# EAGLE design mbedUSBBorderRouter-V_1_0_0 (EAGLE 7.6.0)

## Sheet 1 of 3
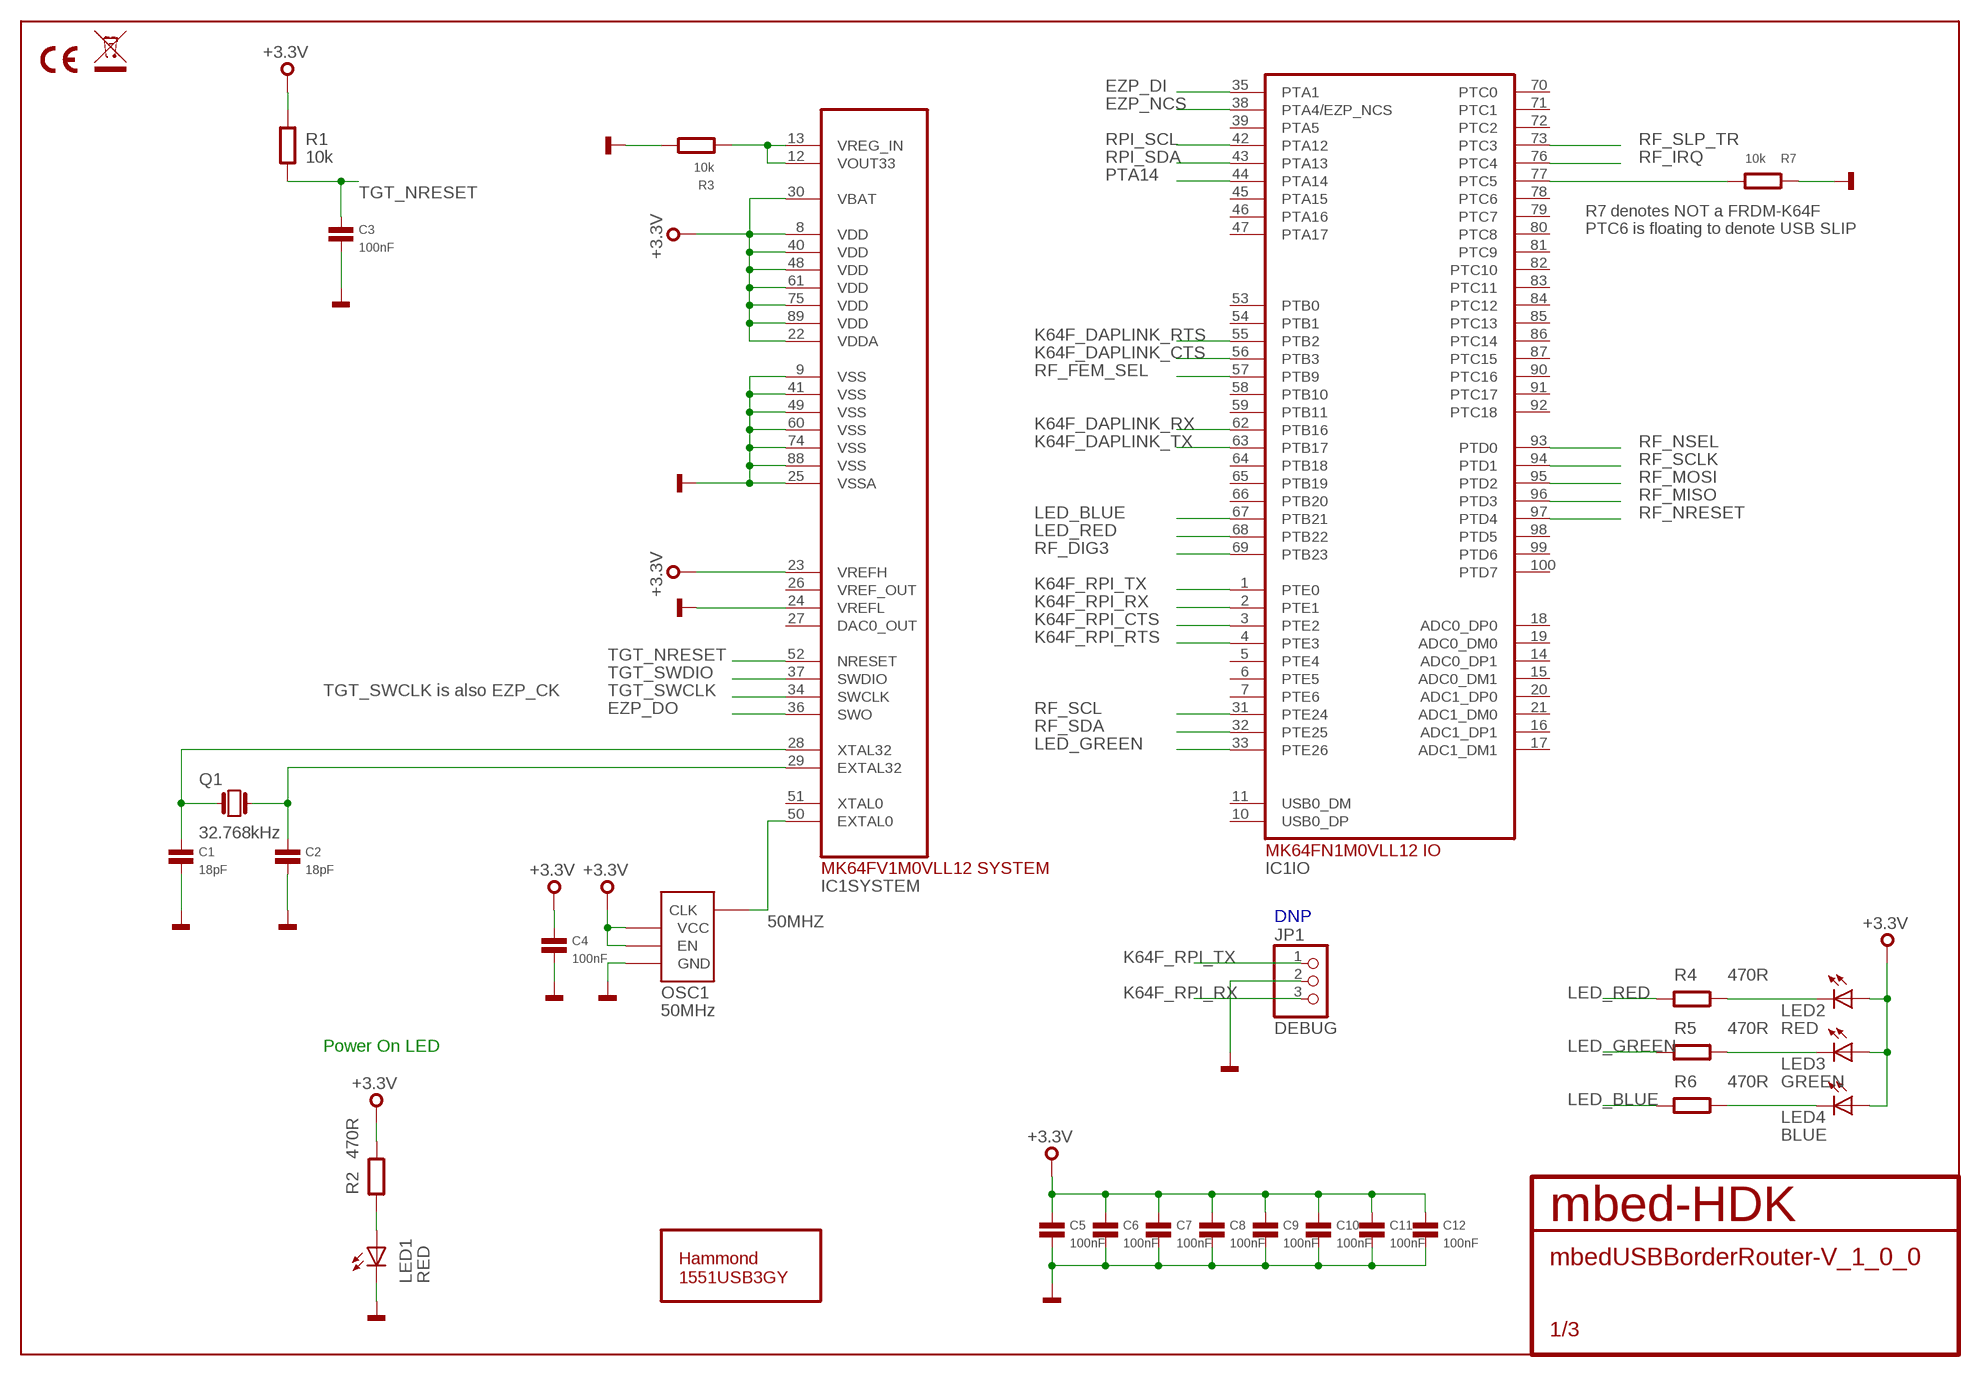
[diagram p0: schematic, sheet 1]

### Parts
BRD1  HAMMOND-1551USB3GY  [HAMMOND-1551USB3GY]
C1  18pF  C0402  [0402]
C2  18pF  C0402  [0402]
C3  100nF  C0402  [0402]
C4  100nF  C0402  [0402]
C5  100nF  C0402  [0402]
C6  100nF  C0402  [0402]
C7  100nF  C0402  [0402]
C8  100nF  C0402  [0402]
C9  100nF  C0402  [0402]
C10  100nF  C0402  [0402]
C11  100nF  C0402  [0402]
C12  100nF  C0402  [0402]
IC1  MK64FN1M0VLL12  [LQFP100]
JP1  DEBUG  PINHD-1X3  [1X03]
LED1  RED  LED0603  [CHIPLED_0603]
LED2  RED  LED0603  [CHIPLED_0603]
LED3  GREEN  LED0603  [CHIPLED_0603]
LED4  BLUE  LED0603  [CHIPLED_0603]
OSC1  50MHz  OSCILLATOR3.2X2.5  [3.2X.2.5]
Q1  32.768kHz  Q_FC135  [FC135]
R1  10k  R0402  [0402]
R2  470R  R0402  [0402]
R3  10k  R0402  [0402]
R4  470R  R0402  [0402]
R5  470R  R0402  [0402]
R6  470R  R0402  [0402]
R7  10k  R0402  [0402]
SS1  CE-MARK  [CE-MARK-0.2]
SS2  WEEE-MARK  [WEEE-MARK-0.2]

### Nets
50MHZ: IC1.50(SYSTEM:EXTAL0) OSC1.P$3(CLK)
+3.3V: C4.1 C5.1 C6.1 C7.1 C8.1 C9.1 C10.1 C11.1 C12.1 IC1.8(SYSTEM:VDD) IC1.22(SYSTEM:VDDA) IC1.23(SYSTEM:VREFH) IC1.30(SYSTEM:VBAT) IC1.40(SYSTEM:VDD) IC1.48(SYSTEM:VDD) IC1.61(SYSTEM:VDD) IC1.75(SYSTEM:VDD) IC1.89(SYSTEM:VDD) LED2.A LED3.A LED4.A OSC1.P$1(EN) OSC1.P$4(VCC) R1.2 R2.2 ; also sheet 2,3
EZP_DI: IC1.35(IO:PTA1)
EZP_DO: IC1.36(SYSTEM:SWO)
EZP_NCS: IC1.38(IO:PTA4/EZP_NCS)
GND: C1.2 C2.2 C3.2 C4.2 C5.2 C6.2 C7.2 C8.2 C9.2 C10.2 C11.2 C12.2 IC1.9(SYSTEM:VSS) IC1.24(SYSTEM:VREFL) IC1.25(SYSTEM:VSSA) IC1.41(SYSTEM:VSS) IC1.49(SYSTEM:VSS) IC1.60(SYSTEM:VSS) IC1.74(SYSTEM:VSS) IC1.88(SYSTEM:VSS) JP1.2 LED1.C OSC1.P$2(GND) R3.2 R7.2 ; also sheet 2,3
K64F_DAPLINK_CTS: IC1.56(IO:PTB3) ; also sheet 3
K64F_DAPLINK_RTS: IC1.55(IO:PTB2) ; also sheet 3
K64F_DAPLINK_RX: IC1.62(IO:PTB16) ; also sheet 3
K64F_DAPLINK_TX: IC1.63(IO:PTB17) ; also sheet 3
K64F_RPI_CTS: IC1.3(IO:PTE2)
K64F_RPI_RTS: IC1.4(IO:PTE3)
K64F_RPI_RX: IC1.2(IO:PTE1) JP1.3
K64F_RPI_TX: IC1.1(IO:PTE0) JP1.1
LED_BLUE: IC1.67(IO:PTB21) R6.1
LED_GREEN: IC1.33(IO:PTE26) R5.1
LED_RED: IC1.68(IO:PTB22) R4.1
N$2: C1.1 IC1.28(SYSTEM:XTAL32) Q1.X1
N$3: C2.1 IC1.29(SYSTEM:EXTAL32) Q1.X2
N$4: IC1.77(IO:PTC5) R7.1
N$6: IC1.12(SYSTEM:VOUT33) IC1.13(SYSTEM:VREG_IN) R3.1
N$8: LED2.C R4.2
N$9: LED3.C R5.2
N$10: LED4.C R6.2
N$17: LED1.A R2.1
PTA14: IC1.44(IO:PTA14)
RF_DIG3: IC1.69(IO:PTB23) ; also sheet 2
RF_FEM_SEL: IC1.57(IO:PTB9) ; also sheet 2
RF_IRQ: IC1.76(IO:PTC4) ; also sheet 2
RF_MISO: IC1.96(IO:PTD3) ; also sheet 2
RF_MOSI: IC1.95(IO:PTD2) ; also sheet 2
RF_NRESET: IC1.97(IO:PTD4) ; also sheet 2
RF_NSEL: IC1.93(IO:PTD0) ; also sheet 2
RF_SCL: IC1.31(IO:PTE24) ; also sheet 2
RF_SCLK: IC1.94(IO:PTD1) ; also sheet 2
RF_SDA: IC1.32(IO:PTE25) ; also sheet 2
RF_SLP_TR: IC1.73(IO:PTC3) ; also sheet 2
RPI_SCL: IC1.42(IO:PTA12)
RPI_SDA: IC1.43(IO:PTA13)
TGT_NRESET: C3.1 IC1.52(SYSTEM:NRESET) R1.1 ; also sheet 3
TGT_SWCLK: IC1.34(SYSTEM:SWCLK) ; also sheet 3
TGT_SWDIO: IC1.37(SYSTEM:SWDIO) ; also sheet 3
Unconnected: IC1.5(IO:PTE4) IC1.6(IO:PTE5) IC1.7(IO:PTE6) IC1.10(IO:USB0_DP) IC1.11(IO:USB0_DM) IC1.14(IO:ADC0_DP1) IC1.15(IO:ADC0_DM1) IC1.16(IO:ADC1_DP1) IC1.17(IO:ADC1_DM1) IC1.18(IO:ADC0_DP0) IC1.19(IO:ADC0_DM0) IC1.20(IO:ADC1_DP0) IC1.21(IO:ADC1_DM0) IC1.26(SYSTEM:VREF_OUT) IC1.27(SYSTEM:DAC0_OUT) IC1.39(IO:PTA5) IC1.45(IO:PTA15) IC1.46(IO:PTA16) IC1.47(IO:PTA17) IC1.51(SYSTEM:XTAL0) IC1.53(IO:PTB0) IC1.54(IO:PTB1) IC1.58(IO:PTB10) IC1.59(IO:PTB11) IC1.64(IO:PTB18) IC1.65(IO:PTB19) IC1.66(IO:PTB20) IC1.70(IO:PTC0) IC1.71(IO:PTC1) IC1.72(IO:PTC2) IC1.78(IO:PTC6) IC1.79(IO:PTC7) IC1.80(IO:PTC8) IC1.81(IO:PTC9) IC1.82(IO:PTC10) IC1.83(IO:PTC11) IC1.84(IO:PTC12) IC1.85(IO:PTC13) IC1.86(IO:PTC14) IC1.87(IO:PTC15) IC1.90(IO:PTC16) IC1.91(IO:PTC17) IC1.92(IO:PTC18) IC1.98(IO:PTD5) IC1.99(IO:PTD6) IC1.100(IO:PTD7)

### Notes on the sheet
- R7 denotes NOT a FRDM-K64F
  PTC6 is floating to denote USB SLIP
- TGT_SWCLK is also EZP_CK
- DNP
- Power On LED

## Sheet 2 of 3
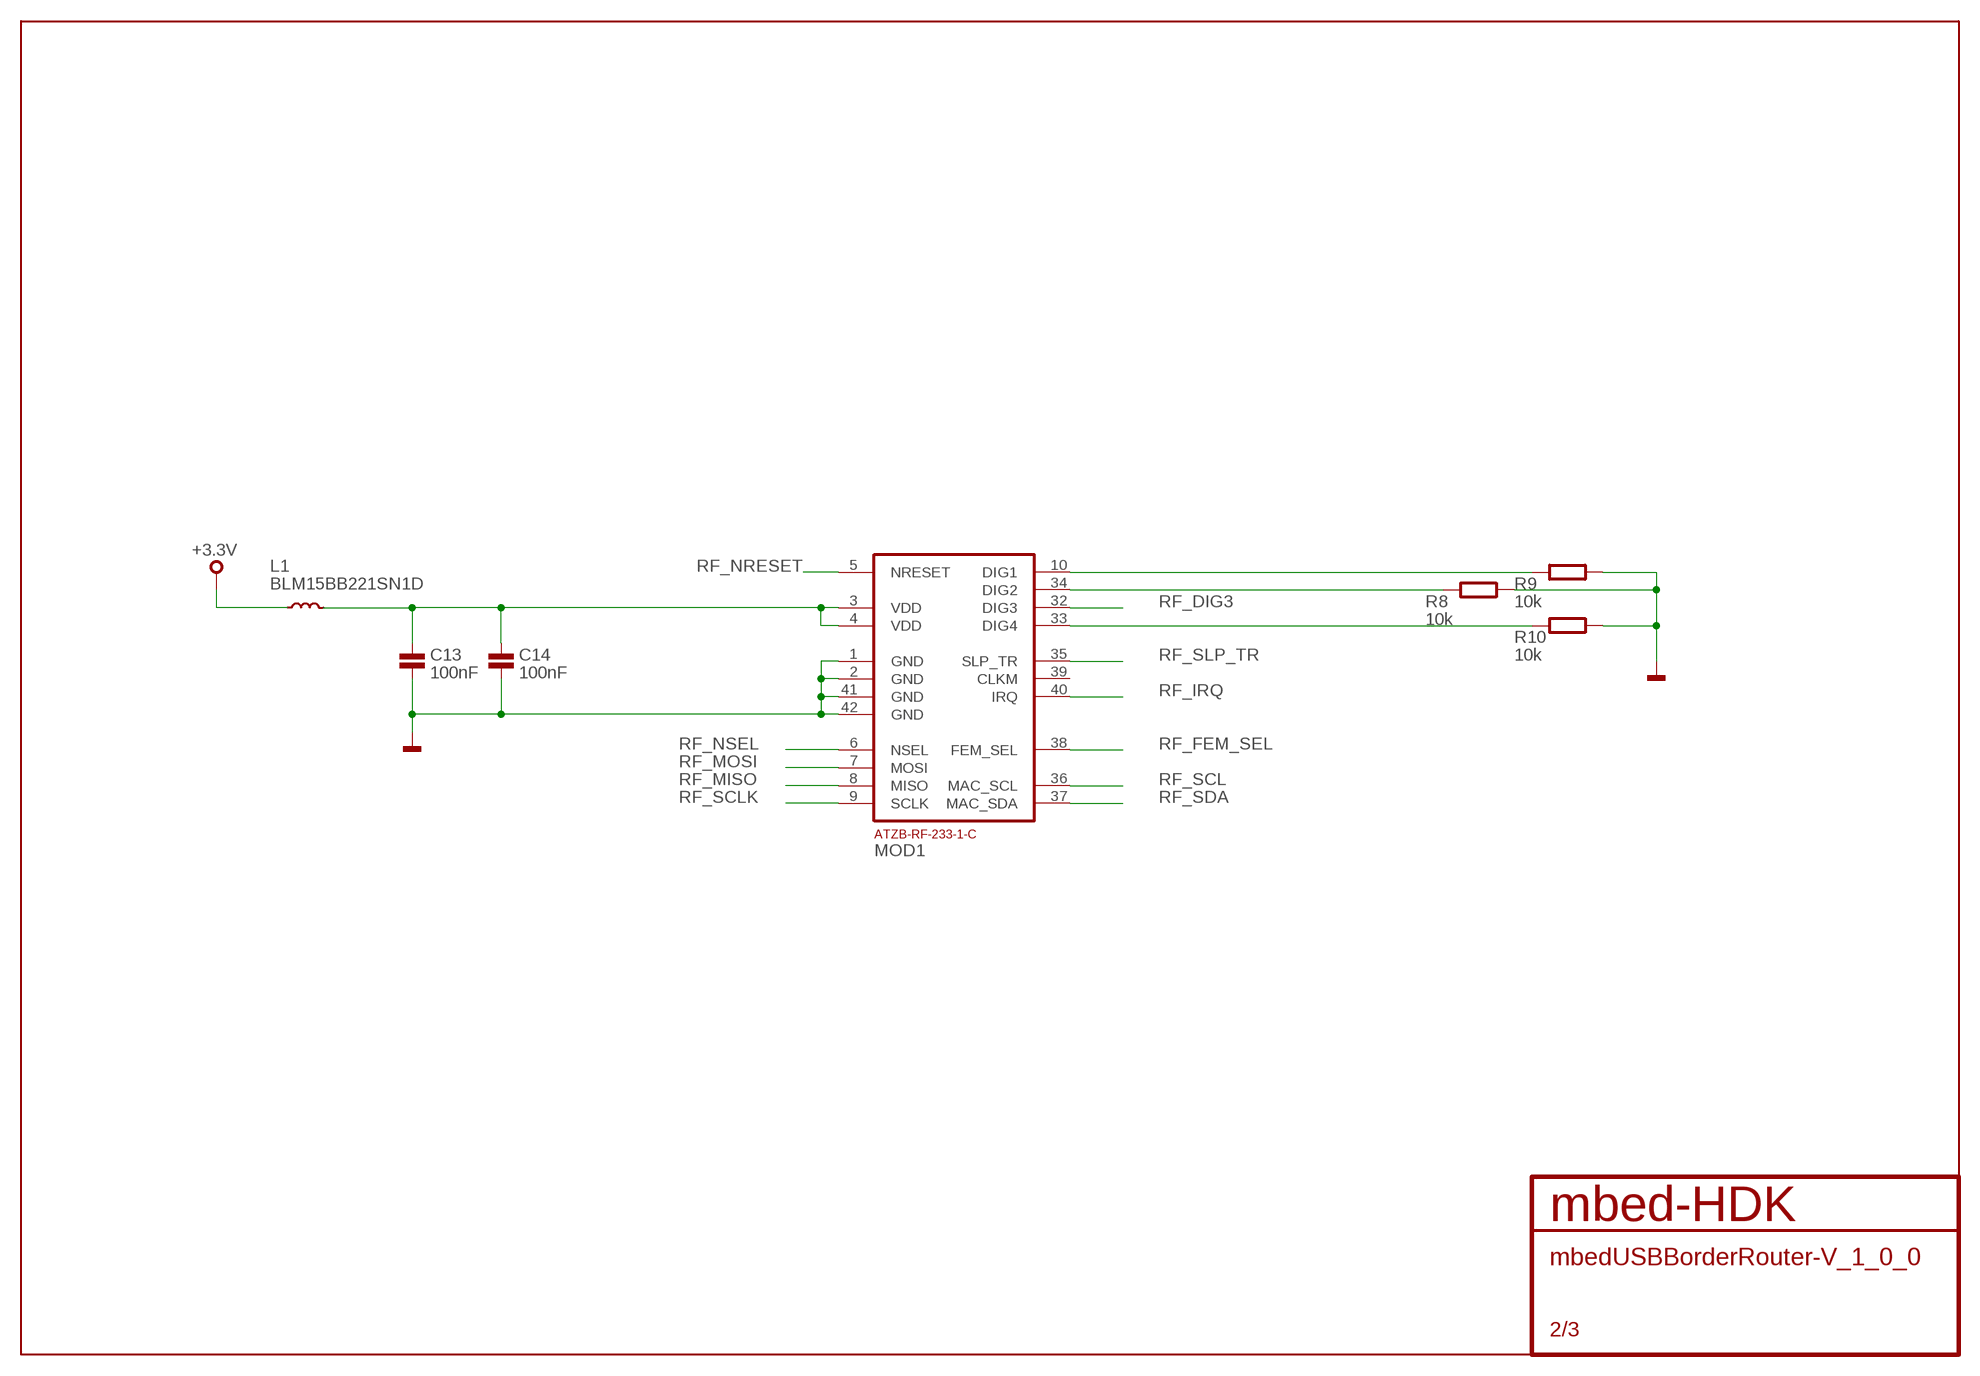
[diagram p1: schematic, sheet 2]

### Parts
C13  100nF  C0402  [0402]
C14  100nF  C0402  [0402]
L1  BLM15BB221SN1D  L0402  [0402]
MOD1  ATZB-RF-233-1-C  [ATZB-RF-233-1-C]
R8  10k  R0402  [0402]
R9  10k  R0402  [0402]
R10  10k  R0402  [0402]

### Nets
+3.3V: L1.1 ; also sheet 1,3
GND: C13.2 C14.2 MOD1.1(GND) MOD1.2(GND) MOD1.41(GND) MOD1.42(GND) R8.2 R9.2 R10.1 ; also sheet 1,3
N$7: MOD1.10(DIG1) R9.1
N$11: MOD1.34(DIG2) R8.1
N$12: MOD1.33(DIG4) R10.2
N$13: C13.1 C14.1 L1.2 MOD1.3(VDD) MOD1.4(VDD)
RF_DIG3: MOD1.32(DIG3) ; also sheet 1
RF_FEM_SEL: MOD1.38(FEM_SEL) ; also sheet 1
RF_IRQ: MOD1.40(IRQ) ; also sheet 1
RF_MISO: MOD1.8(MISO) ; also sheet 1
RF_MOSI: MOD1.7(MOSI) ; also sheet 1
RF_NRESET: MOD1.5(NRESET) ; also sheet 1
RF_NSEL: MOD1.6(NSEL) ; also sheet 1
RF_SCL: MOD1.36(MAC_SCL) ; also sheet 1
RF_SCLK: MOD1.9(SCLK) ; also sheet 1
RF_SDA: MOD1.37(MAC_SDA) ; also sheet 1
RF_SLP_TR: MOD1.35(SLP_TR) ; also sheet 1
Unconnected: MOD1.39(CLKM)

## Sheet 3 of 3
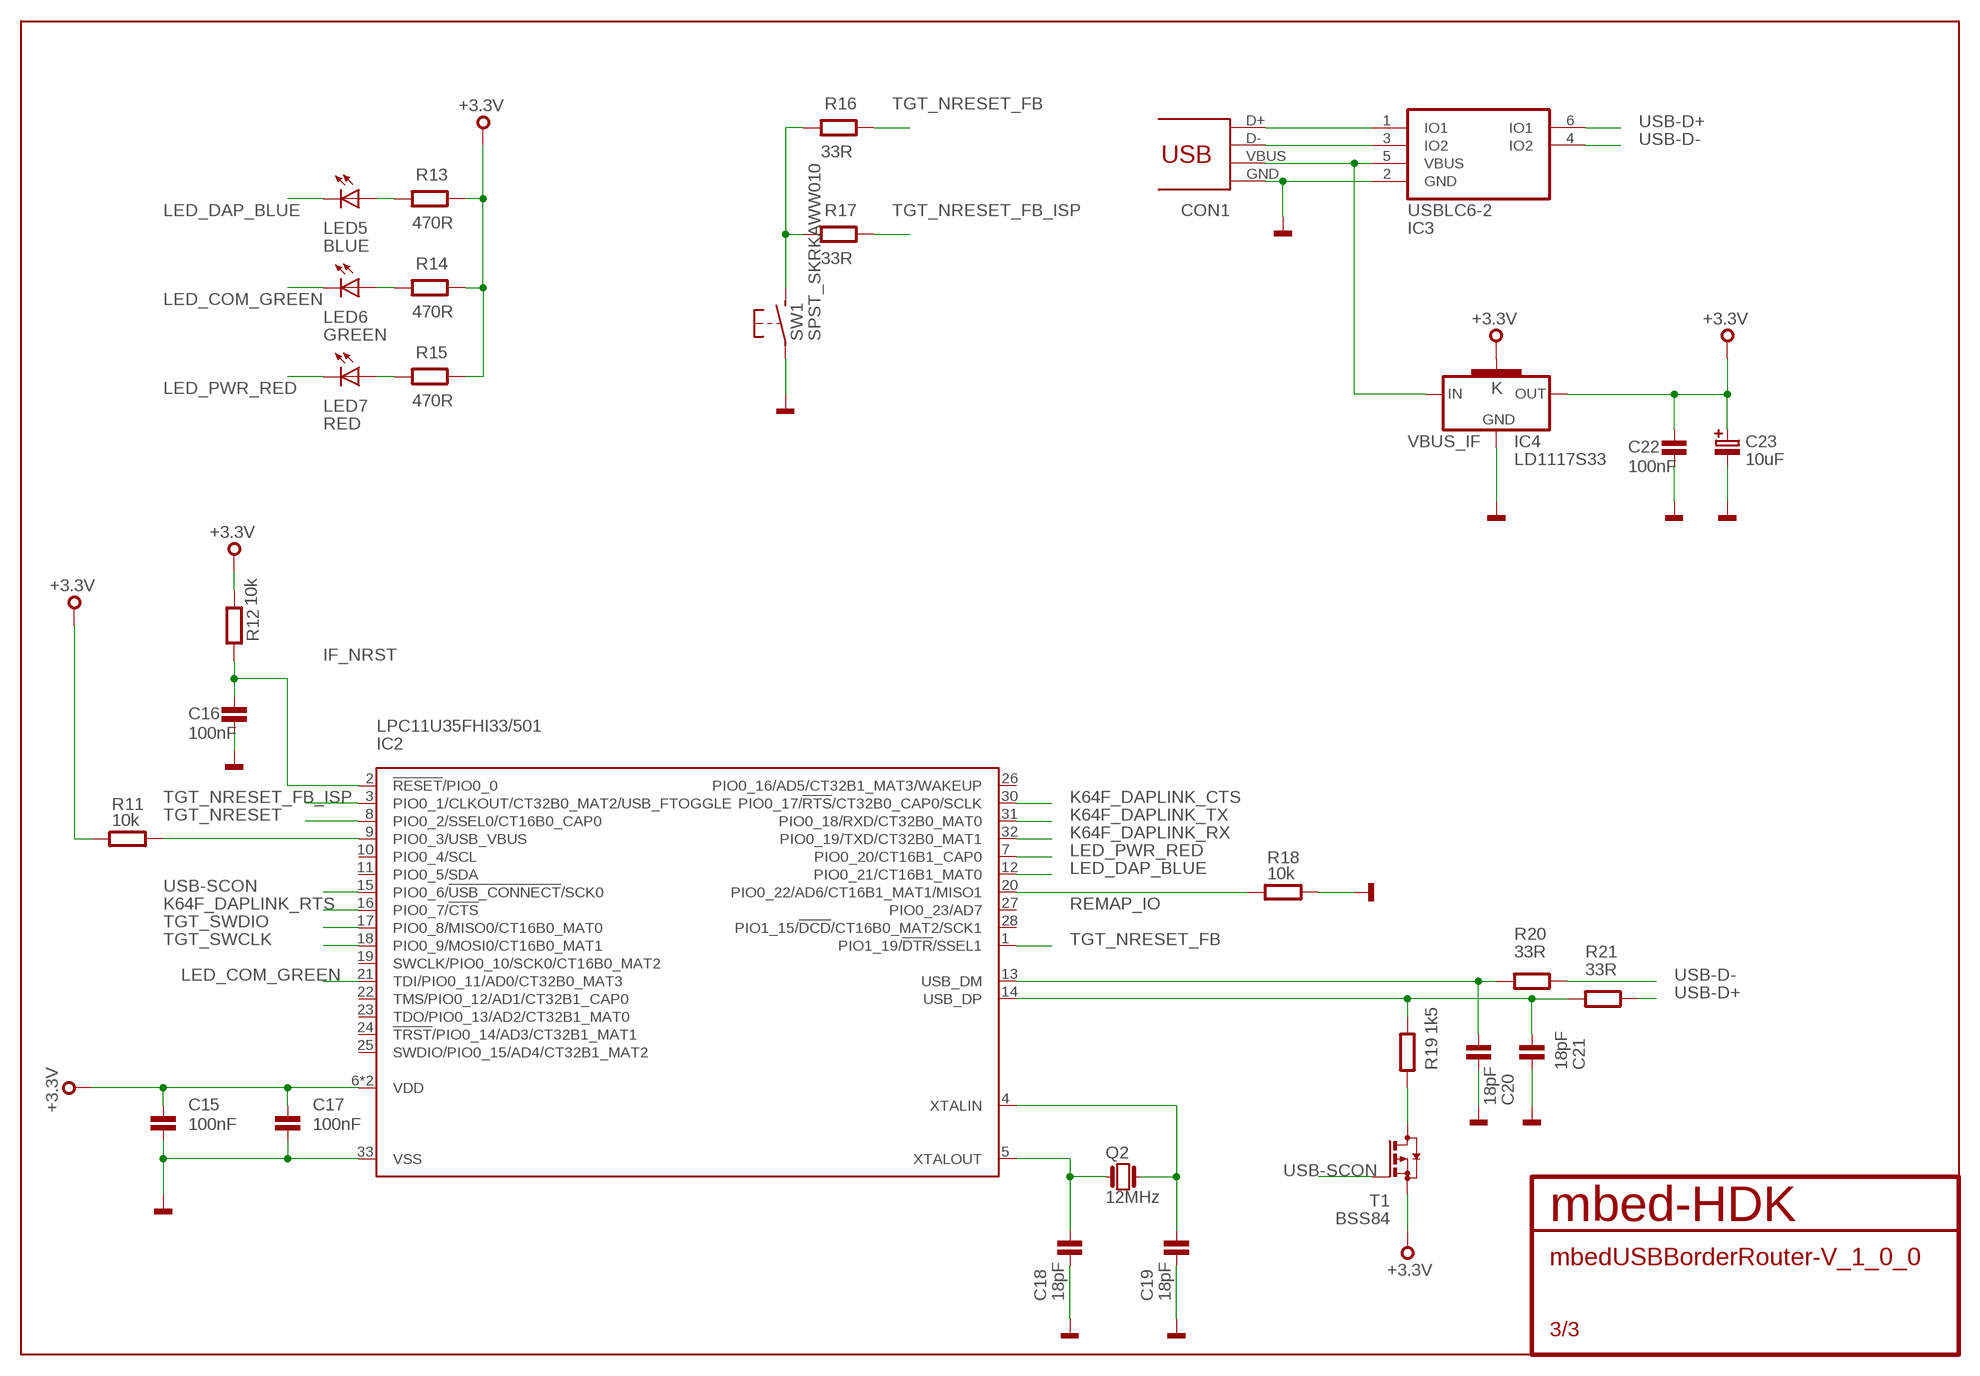
[diagram p2: schematic, sheet 3]

### Parts
C15  100nF  C0402  [0402]
C16  100nF  C0402  [0402]
C17  100nF  C0402  [0402]
C18  18pF  C0402  [0402]
C19  18pF  C0402  [0402]
C20  18pF  C0402  [0402]
C21  18pF  C0402  [0402]
C22  100nF  C0402  [0402]
C23  10uF  C-POL_B  [CASE-B]
CON1  USB  [MOLEX-48037-2200]
IC2  LPC11U35FHI33/501  [SOT617-3]
IC3  USBLC6-2SC6  [SOT23-6L]
IC4  LD1117S33  [SOT223]
LED5  BLUE  LED0603  [CHIPLED_0603]
LED6  GREEN  LED0603  [CHIPLED_0603]
LED7  RED  LED0603  [CHIPLED_0603]
Q2  12MHz  Q_3.2X2.5  [3.2X.2.5]
R11  10k  R0402  [0402]
R12  10k  R0402  [0402]
R13  470R  R0402  [0402]
R14  470R  R0402  [0402]
R15  470R  R0402  [0402]
R16  33R  R0402  [0402]
R17  33R  R0402  [0402]
R18  10k  R0402  [0402]
R19  1k5  R0402  [0402]
R20  33R  R0402  [0402]
R21  33R  R0402  [0402]
SW1  SPST_SKRKAWW010  [SKRKAEE010]
T1  BSS84  [SOT23]

### Nets
+3.3V: C15.1 C17.1 C22.1 C23.1 IC2.6(VDD) IC2.29(VDD) IC4.2(OUT) IC4.4(K) R11.2 R12.2 R13.1 R14.1 R15.1 T1.2(S) ; also sheet 1,2
GND: C15.2 C16.2 C17.2 C18.2 C19.2 C20.2 C21.2 C22.2 C23.2 CON1.GND IC2.33(VSS) IC3.2(GND) IC4.1(GND) R18.1 SW1.P$1(P) ; also sheet 1,2
IF_NRST: C16.1 IC2.2(!RESET!/PIO0_0) R12.1
K64F_DAPLINK_CTS: IC2.30(PIO0_17/!RTS!/CT32B0_CAP0/SCLK) ; also sheet 1
K64F_DAPLINK_RTS: IC2.16(PIO0_7/!CTS!) ; also sheet 1
K64F_DAPLINK_RX: IC2.32(PIO0_19/TXD/CT32B0_MAT1) ; also sheet 1
K64F_DAPLINK_TX: IC2.31(PIO0_18/RXD/CT32B0_MAT0) ; also sheet 1
LED_COM_GREEN: IC2.21(TDI/PIO0_11/AD0/CT32B0_MAT3) LED6.C
LED_DAP_BLUE: IC2.12(PIO0_21/CT16B1_MAT0) LED5.C
LED_PWR_RED: IC2.7(PIO0_20/CT16B1_CAP0) LED7.C
N$5: R16.2 R17.2 SW1.P$2(S)
N$18: C18.1 IC2.5(XTALOUT) Q2.P$1
N$19: C19.1 IC2.4(XTALIN) Q2.P$3
N$20: IC2.9(PIO0_3/USB_VBUS) R11.1
N$23: R19.1 T1.3(D)
N$36: LED6.A R14.2
N$37: LED7.A R15.2
N$38: LED5.A R13.2
N$39: CON1.D+ IC3.1(IO1)
N$40: CON1.D- IC3.3(IO2)
REMAP_IO: IC2.20(PIO0_22/AD6/CT16B1_MAT1/MISO1) R18.2
TGT_NRESET: IC2.8(PIO0_2/SSEL0/CT16B0_CAP0) ; also sheet 1
TGT_NRESET_FB: IC2.1(PIO1_19/!DTR!/SSEL1) R16.1
TGT_NRESET_FB_ISP: IC2.3(PIO0_1/CLKOUT/CT32B0_MAT2/USB_FTOGGLE) R17.1
TGT_SWCLK: IC2.18(PIO0_9/MOSI0/CT16B0_MAT1) ; also sheet 1
TGT_SWDIO: IC2.17(PIO0_8/MISO0/CT16B0_MAT0) ; also sheet 1
USB-D+: IC3.6(IO1) R21.1
USB-D-: IC3.4(IO2) R20.1
USB-DM: C20.1 IC2.13(USB_DM) R20.2
USB-DP: C21.1 IC2.14(USB_DP) R19.2 R21.2
USB-SCON: IC2.15(PIO0_6/!USB_CONNECT!/SCK0) T1.1(G)
VBUS_IF: CON1.VBUS IC3.5(VBUS) IC4.3(IN)
Unconnected: IC2.10(PIO0_4/SCL) IC2.11(PIO0_5/SDA) IC2.19(SWCLK/PIO0_10/SCK0/CT16B0_MAT2) IC2.22(TMS/PIO0_12/AD1/CT32B1_CAP0) IC2.23(TDO/PIO0_13/AD2/CT32B1_MAT0) IC2.24(!TRST!/PIO0_14/AD3/CT32B1_MAT1) IC2.25(SWDIO/PIO0_15/AD4/CT32B1_MAT2) IC2.26(PIO0_16/AD5/CT32B1_MAT3/WAKEUP) IC2.27(PIO0_23/AD7) IC2.28(PIO1_15/!DCD!/CT16B0_MAT2/SCK1)

## Library data of the parts
BRD1 = mbed-HDK:HAMMOND-1551USB3GY
C1-C22 = mbed-HDK:C: Capacitor
C23 = mbed-HDK:C-POL: Polarised capacitor
CON1 = mbed-HDK:USB: USB Connectors
IC1 = mbed-HDK:MK64FN1M0VLL12
IC2 = mbed-HDK:LPC11U35FHI33: 32-bit ARM Cortex-M0 microcontroller; up to 128 kB flash; up to 12 kB SRAM and 4 kB EEPROM; USB device; USART The LPC11U3x are a ARM Cortex-M0 based, low-cost 32-bit MCU family, designed for 8/16-bit microcontroller applications, offering performance, low power, simple instruction set and memory addressing together with reduced code size compared to existing 8/16-bit architectures. The LPC11U3x operate at CPU frequencies of up to 50 MHz. Equipped with a highly flexible and configurable Full Speed USB 2.0 device controller, the LPC11U3x brings unparalleled design flexibility and seamless integration to today’s demanding connectivity solutions. The peripheral complement of the LPC11U3x includes up to 128 kB of flash memory, up to 12 kB of SRAM data memory and 4 kB EEPROM, one Fast-mode Plus I 2 C-bus interface, one RS-485/EIA-485 USART with support for synchronous mode and smart card interface, two SSP interfaces, four general purpose counter/timers, a 10-bit ADC, and up to 54 general purpose I/O pins. AAL Eindhoven MK; FLASH: 64kB; GPIO: 26; SRAM: 12kB
IC3 = mbed-HDK:USBLC6-2
IC4 = mbed-HDK:LD1117S33: VOLTAGE REGULATOR SMD 3,3V
JP1 = mbed-HDK:PINHD-1X3: PIN HEADER
L1 = mbed-HDK:L: Inductor
LED1-LED7 = mbed-HDK:LED: SMD LED
MOD1 = mbed-HDK:ATZB-RF-233-1-C
OSC1 = mbed-HDK:OSCILLATOR
Q1 Q2 = mbed-HDK:Q
R1-R21 = mbed-HDK:R
SS1 = mbed-HDK-misc-Silkscreen:CE-MARK
SS2 = mbed-HDK-misc-Silkscreen:WEEE-MARK
SW1 = mbed-HDK:SPST
T1 = mbed-HDK:BSS84: P-CHANNEL MOS FET

## Net classes
0 default: width 0.152 mm, drill 0.305 mm, clearance 0.152 mm

## Board
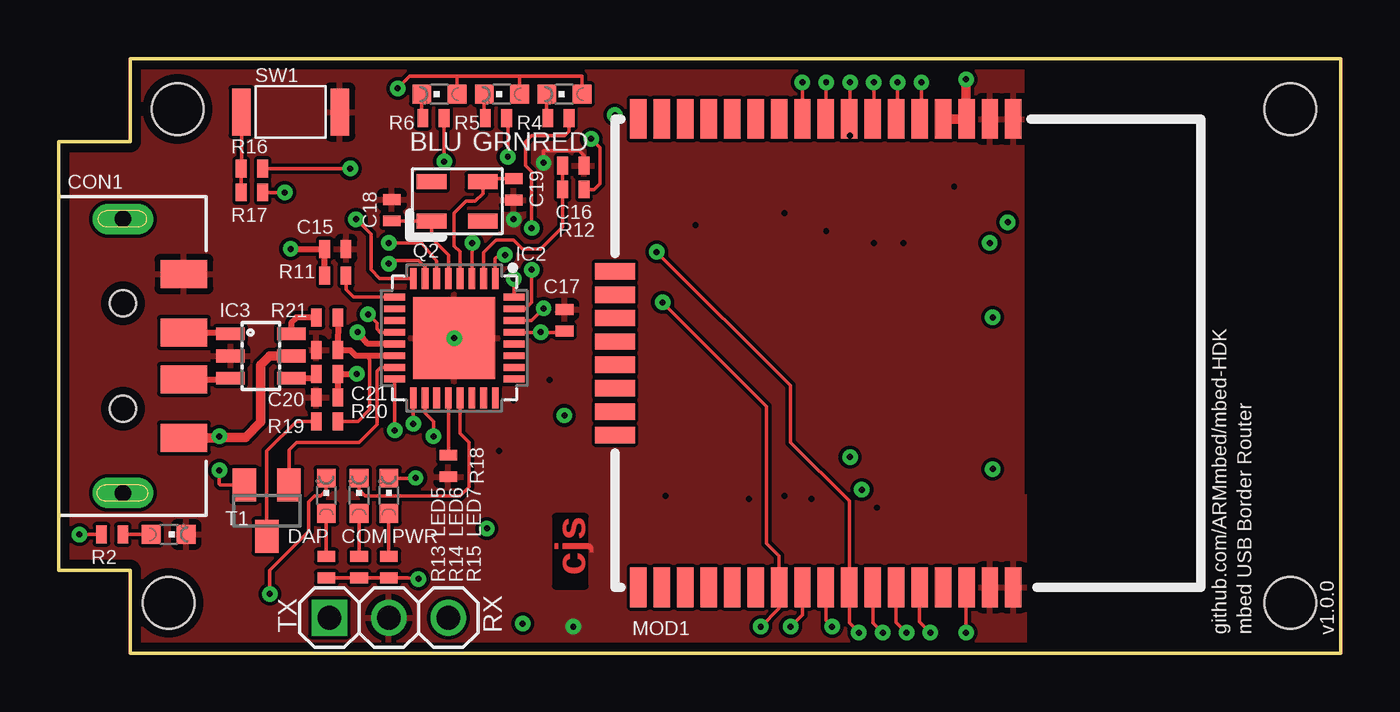
[diagram p3: board, top side]
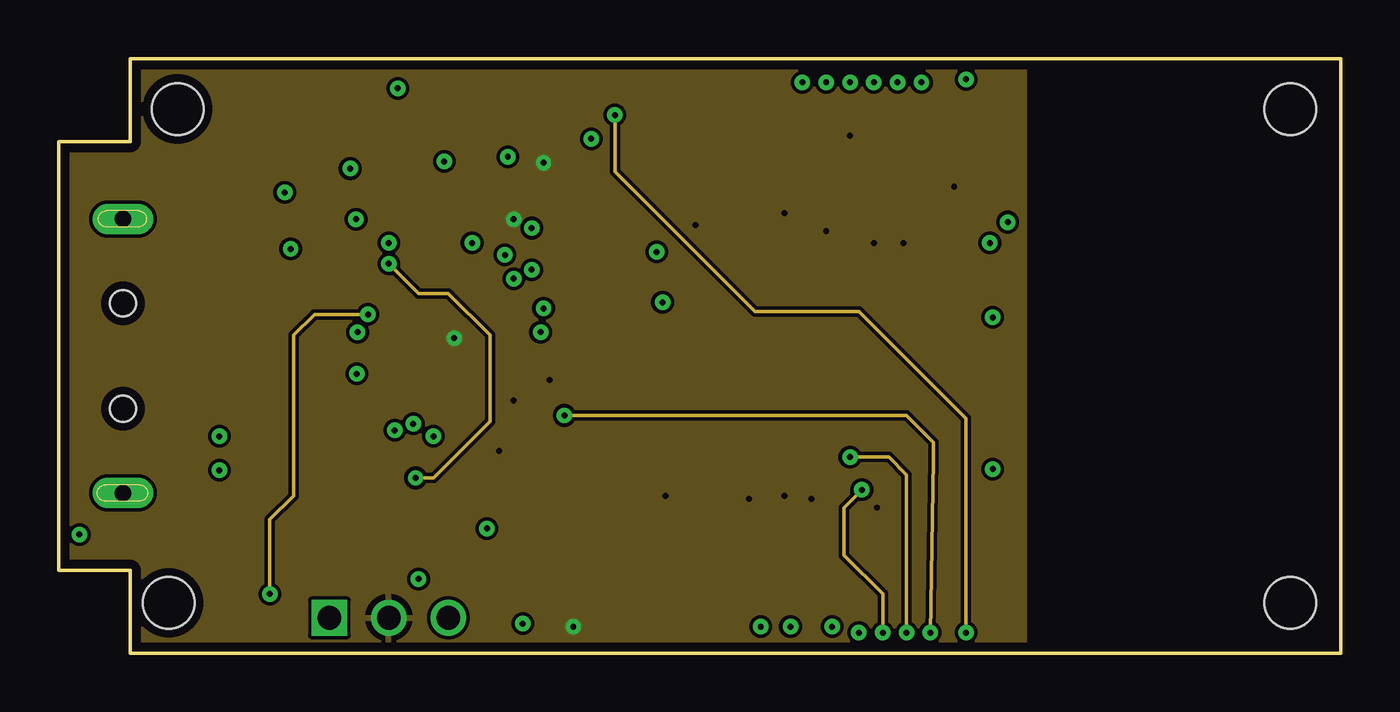
[diagram p4: board, inner layer GND]
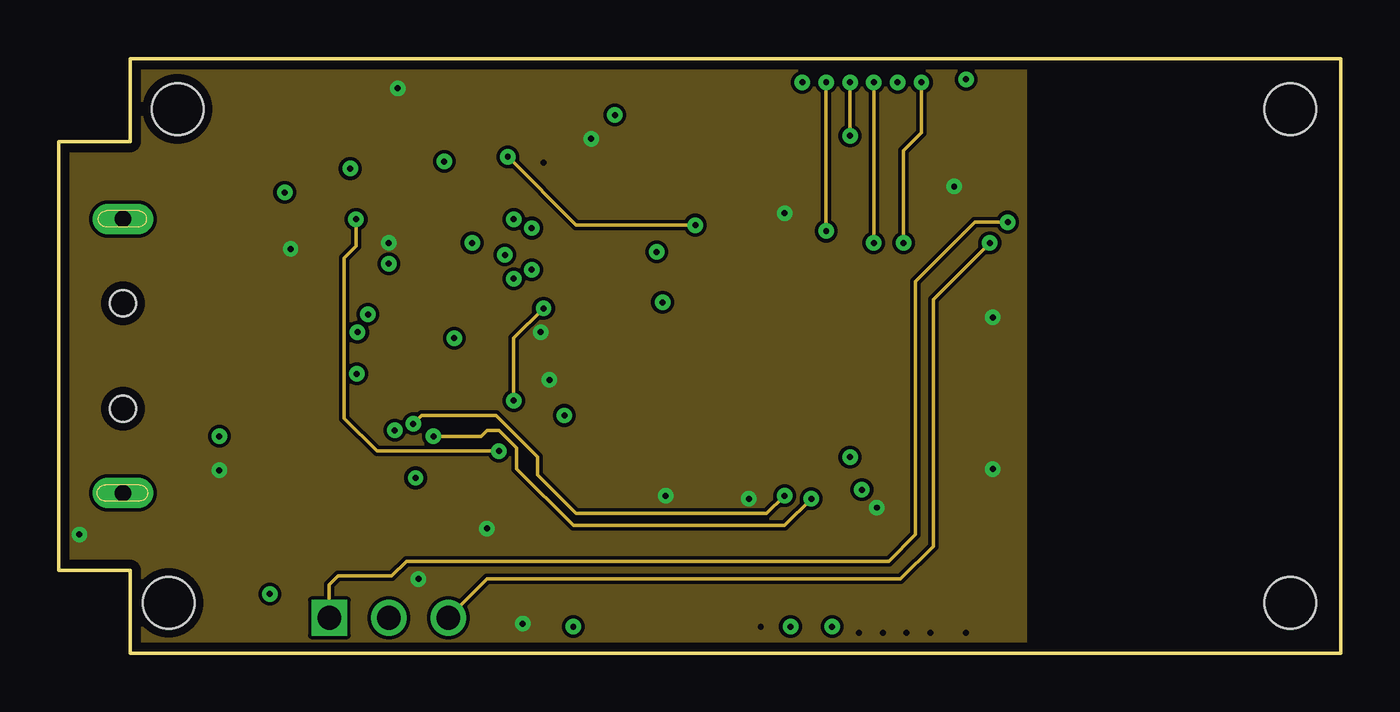
[diagram p5: board, inner layer +3.3v]
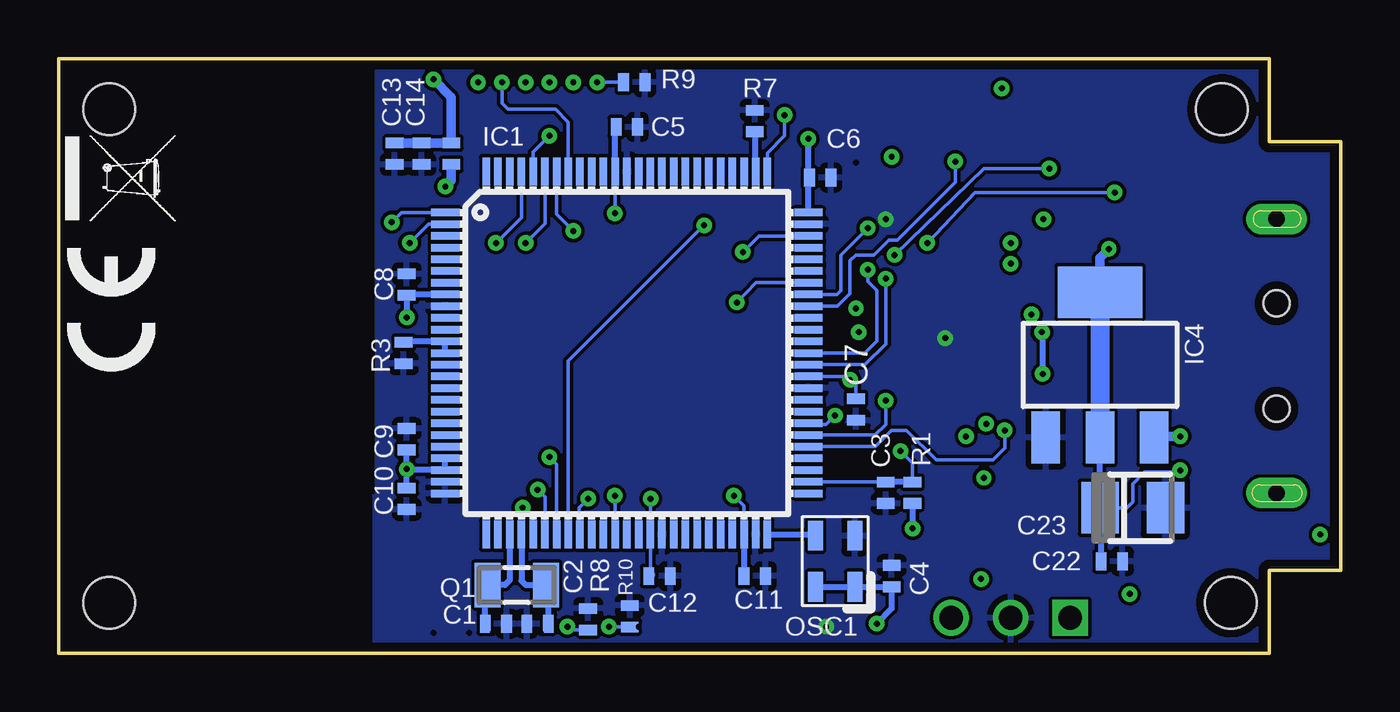
[diagram p6: board, bottom side, seen from below]

Size 54.74 x 25.4 mm. Coordinates in mm from the lower left corner, seen from the top.
Copper layers ((1*2)*(15*16)): Top 0.035mm / dielectric 0.8mm / GND 0.035mm / dielectric 0.15mm / +3.3v 0.035mm / dielectric 0.8mm / Bottom 0.035mm
Design rules "mbed-HDK-6-6": minimum track width 6mil, minimum drill 9mil, track to track 6mil, track to pad 6mil, pad to pad 6mil, via to via 6mil, smd to smd 6mil, copper to edge 15mil, drill to drill 8mil, minimum pad ring 10mil, minimum via ring 8mil, stop-mask expansion 4mil, vias tented up to drill 0mil, thermal gap 10mil

### Footprints (pad centres in the part's own frame; a part is rotated, then mirrored left to right if it is on the bottom)
HAMMOND-1551USB3GY = hole 2.2: -23.749,10.541; -24.13,-10.541; 23.749,10.541; 23.749,-10.541
0402 = smd 0.457 x 0.762: 1 -0.457,0; 2 0.457,0
CASE-B = smd 1.6 x 2.2: 1 -1.4,0; 2 1.4,0
MOLEX-48037-2200 = smd 1.2 x 2: D+ -1,5.35; D- 1,5.35; GND -3.5,5.35; VBUS 3.5,5.35 | drill 0.7 pad 1.3 long: P$5 5.85,2.75; P$6 -5.85,2.75 | hole 1.1: -2.25,2.75; 2.25,2.75
LQFP100 = smd 1.2 x 0.32: 1 -7.75,6; 2 -7.75,5.5; 3 -7.75,5; 4 -7.75,4.5; 5 -7.75,4; 6 -7.75,3.5; 7 -7.75,3; 8 -7.75,2.5; 9 -7.75,2; 10 -7.75,1.5; 11 -7.75,1; 12 -7.75,0.5; 13 -7.75,0; 14 -7.75,-0.5; 15 -7.75,-1; 16 -7.75,-1.5; 17 -7.75,-2; 18 -7.75,-2.5; 19 -7.75,-3; 20 -7.75,-3.5; 21 -7.75,-4; 22 -7.75,-4.5; 23 -7.75,-5; 24 -7.75,-5.5; 25 -7.75,-6; 51 7.75,-6; 52 7.75,-5.5; 53 7.75,-5; 54 7.75,-4.5; 55 7.75,-4; 56 7.75,-3.5; 57 7.75,-3; 58 7.75,-2.5; 59 7.75,-2; 60 7.75,-1.5; 61 7.75,-1; 62 7.75,-0.5; 63 7.75,0; 64 7.75,0.5; 65 7.75,1; 66 7.75,1.5; 67 7.75,2; 68 7.75,2.5; 69 7.75,3; 70 7.75,3.5; 71 7.75,4; 72 7.75,4.5; 73 7.75,5; 74 7.75,5.5; 75 7.75,6 | smd 0.32 x 1.2: 26 -6,-7.75; 27 -5.5,-7.75; 28 -5,-7.75; 29 -4.5,-7.75; 30 -4,-7.75; 31 -3.5,-7.75; 32 -3,-7.75; 33 -2.5,-7.75; 34 -2,-7.75; 35 -1.5,-7.75; 36 -1,-7.75; 37 -0.5,-7.75; 38 0,-7.75; 39 0.5,-7.75; 40 1,-7.75; 41 1.5,-7.75; 42 2,-7.75; 43 2.5,-7.75; 44 3,-7.75; 45 3.5,-7.75; 46 4,-7.75; 47 4.5,-7.75; 48 5,-7.75; 49 5.5,-7.75; 50 6,-7.75; 76 6,7.75; 77 5.5,7.75; 78 5,7.75; 79 4.5,7.75; 80 4,7.75; 81 3.5,7.75; 82 3,7.75; 83 2.5,7.75; 84 2,7.75; 85 1.5,7.75; 86 1,7.75; 87 0.5,7.75; 88 0,7.75; 89 -0.5,7.75; 90 -1,7.75; 91 -1.5,7.75; 92 -2,7.75; 93 -2.5,7.75; 94 -3,7.75; 95 -3.5,7.75; 96 -4,7.75; 97 -4.5,7.75; 98 -5,7.75; 99 -5.5,7.75; 100 -6,7.75
SOT617-3 = smd 0.9 x 0.29: 1 -2.55,1.75; 2 -2.55,1.25; 3 -2.55,0.75; 4 -2.55,0.25; 5 -2.55,-0.25; 6 -2.55,-0.75; 7 -2.55,-1.25; 8 -2.55,-1.75; 17 2.55,-1.75; 18 2.55,-1.25; 19 2.55,-0.75; 20 2.55,-0.25; 21 2.55,0.25; 22 2.55,0.75; 23 2.55,1.25; 24 2.55,1.75 | smd 0.29 x 0.9: 9 -1.75,-2.55; 10 -1.25,-2.55; 11 -0.75,-2.55; 12 -0.25,-2.55; 13 0.25,-2.55; 14 0.75,-2.55; 15 1.25,-2.55; 16 1.75,-2.55; 25 1.75,2.55; 26 1.25,2.55; 27 0.75,2.55; 28 0.25,2.55; 29 -0.25,2.55; 30 -0.75,2.55; 31 -1.25,2.55; 32 -1.75,2.55 | smd 3.5 x 3.5: 33 0,0
SOT23-6L = smd 0.55 x 1.2: 1 -0.95,-1.3; 2 0,-1.3; 3 0.95,-1.3; 4 0.95,1.3; 5 0,1.3; 6 -0.95,1.3
SOT223 = smd 1.219 x 2.235: 1 -2.311,-3.099; 2 0,-3.099; 3 2.311,-3.099 | smd 3.6 x 2.2: 4 0,3.099
1X03 = drill 1.016 square: 1 -2.54,0 | drill 1.016: 2 0,0; 3 2.54,0
CHIPLED_0603 = smd 0.8 x 0.8: A 0,-0.75; C 0,0.75
ATZB-RF-233-1-C = smd 0.7 x 1.7: 1 16,20; 2 15,20; 3 14,20; 4 13,20; 5 12,20; 6 11,20; 7 10,20; 8 9,20; 9 8,20; 10 7,20; 11 6,20; 12 5,20; 13 4,20; 14 3,20; 15 2,20; 16 1,20; 17 0,20; 26 0,0; 27 1,0; 28 2,0; 29 3,0; 30 4,0; 31 5,0; 32 6,0; 33 7,0; 34 8,0; 35 9,0; 36 10,0; 37 11,0; 38 12,0; 39 13,0; 40 14,0; 41 15,0; 42 16,0 | smd 1.7 x 0.7: 18 -1,13.5; 19 -1,12.5; 20 -1,11.5; 21 -1,10.5; 22 -1,9.5; 23 -1,8.5; 24 -1,7.5; 25 -1,6.5
3.2X.2.5 = smd 1.27 x 0.635: P$1 -1.092,-0.838; P$2 1.092,-0.838; P$3 1.092,0.838; P$4 -1.092,0.838
FC135 = smd 1.1 x 1.9: X1 -1.25,0; X2 1.25,0
SKRKAEE010 = smd 0.8 x 2: P$1 -2.1,0; P$2 2.1,0
SOT23 = smd 1 x 1.4: 1 -0.95,-1.1; 2 0.95,-1.1; 3 0,1.1

### Placement (x,y rotation side)
BRD1  28.83,12.7 0 top
C1  36.07,1.27 0 bottom
C2  34.29,1.27 180 bottom
C3  19.43,6.86 270 bottom
C4  19.18,3.3 90 bottom
C5  30.48,22.48 0 bottom
C6  22.23,20.32 0 bottom
C7  20.7,10.41 270 bottom
C8  39.88,15.75 90 bottom
C9  39.88,9.14 90 bottom
C10  39.88,6.6 270 bottom
C11  25.02,3.3 0 bottom
C12  29.08,3.3 0 bottom
C13  40.39,21.34 270 bottom
C14  39.24,21.34 270 bottom
C15  11.81,17.27 0 top
C16  21.97,20.83 0 top
C17  21.59,14.22 90 top
C18  14.22,18.92 90 top
C19  19.43,19.81 270 top
C20  11.46,10.92 180 top
C21  11.46,12.95 180 top
C22  9.78,3.94 0 bottom
C23  8.89,6.22 0 bottom
CON1  0,12.7 270 top
IC1  30.48,12.83 0 bottom
IC2  16.89,13.46 270 top
IC3  8.64,12.7 270 top
IC4  10.29,12.32 0 bottom
JP1  14.1,1.52 0 top
L1  37.97,21.34 90 bottom
LED1  4.7,5.08 270 top
LED2  21.59,23.88 90 top
LED3  18.92,23.88 90 top
LED4  16.26,23.88 90 top
LED5  11.43,6.73 0 top
LED6  12.83,6.73 0 top
LED7  14.1,6.73 0 top
MOD1  24.75,2.82 0 top
OSC1  21.59,3.94 90 bottom
Q1  35.18,2.92 0 bottom
Q2  17.02,19.3 0 top
R1  18.29,6.86 270 bottom
R2  2.29,5.08 180 top
R3  40.01,12.83 270 bottom
R4  21.34,22.86 180 top
R5  18.67,22.86 180 top
R6  16,22.86 180 top
R7  25.02,22.73 90 bottom
R8  32.13,1.46 90 bottom
R9  30.16,24.38 0 bottom
R10  30.35,1.59 270 bottom
R11  11.81,16.13 180 top
R12  21.97,19.81 0 top
R13  11.43,3.68 90 top
R14  12.83,3.68 90 top
R15  14.1,3.68 90 top
R16  8.25,20.7 180 top
R17  8.25,19.68 180 top
R18  16.64,8 90 top
R19  11.46,9.91 0 top
R20  11.46,11.94 0 top
R21  11.47,14.34 0 top
SS1  54.58,11.79 90 top
SS2  54.74,18.19 90 top
SW1  9.91,23.11 180 top
T1  8.89,6.1 180 top

### Tracks (layer width: path | path; a pad name or v marks a point on that pad's centre or on a via)
50MHZ
  Bottom 0.254: IC1.50 22.48,5.08 OSC1.P$3
+3.3V  (via drill 0.25, 0.25 layers 15-16)
  Top 0.152: LED4.A 17.01,24.63 17.02,24.64 | 17.02,24.64 14.99,24.64 v14.48,24.13 | LED3.A 19.67,24.63 19.69,24.64 | 19.69,24.64 17.02,24.64 | LED2.A 22.34,24.63 22.35,24.64 19.69,24.64 | R2.2 v0.89,5.08 | C17.1 21.54,13.71 v20.58,13.71 v20.57,13.72 v20.57,13.71 IC2.29 | R12.2 22.86,19.81 23.11,20.07 23.11,21.59 v22.73,21.97 | IC2.6 16.14,16.75 15.49,17.53 v14.1,17.53 | T1.2 6.9,7.2 6.86,7.24 v6.86,7.82 | R13.1 R14.1 R15.1 14.91,3.23 v15.37,3.17
  Top 0.254: v9.91,17.27 C15.1 R11.2
  Bottom 0.152: IC1.61 21.1,11.83 v20.96,11.68 20.7,11.43 C7.1 | 29.48,3.36 IC1.40 29.48,6.59 v29.46,6.6 | IC1.30 34.48,5.78 v34.92,6.22 | IC1.48 25.48,6.3 v25.91,6.73 | IC1.89 v30.98,18.8 v30.99,18.8 | C23.1 9.14,6.22 8.89,6.48 8.89,7.24 8.38,7.75 6.96,7.75 6.88,7.82
  Bottom 0.254: 10.16,3.94 C22.1 10.24,6.17 C23.1 IC4.2 | IC1.22 IC1.23 39.88,7.83 v39.88,7.87 | C10.1 v39.88,7.87 | v39.88,7.87 C9.1 | IC1.8 39.88,15.33 C8.1 v39.88,14.35 | IC1.89 30.98,22.44 C5.1 | R1.2 v18.29,5.33 | OSC1.P$4 OSC1.P$1 C4.1 19.18,1.9 v19.81,1.27 | IC1.48 C11.1 | IC1.75 22.73,20.27 C6.1 22.73,20.37 v22.73,21.97
  Bottom 0.406: IC4.4 10.29,16.89 v9.91,17.27 | L1.1 37.97,20.19 v38.23,19.94 | 29.48,3.36 29.54,3.36 C12.1
  Bottom 0.813: 10.16,9.73 IC4.2 IC4.4
  pour +3.3v: 3.05,0 3.05,3.56 0,3.56 0,21.84 3.05,21.84 3.05,25.4 41.27,25.4 41.27,0
GND  (via drill 0.25, 0.25 layers 1-2)
  Top 0.152: C16.2 22.43,21.26 22.23,21.46 20.7,21.46 v20.7,20.95
  other vias: 16.89,13.46 19.43,18.54 21.97,1.14
  pour GND: 0,3.56 3.05,3.56 3.05,0 41.27,0 41.27,25.4 3.05,25.4 3.05,21.84 0,21.84
  pour Top: 3.05,0 3.05,3.56 0,3.56 0,21.84 3.05,21.84 3.05,25.4 41.27,25.4 41.27,0
  pour Bottom: 3.05,0 3.05,3.56 0,3.56 0,21.84 3.05,21.84 3.05,25.4 41.27,25.4 41.27,0
IF_NRST
  Top 0.152: IC2.2 18.14,17.12 18.67,17.65 19.43,17.65 19.81,17.27 20.57,17.27 21.51,18.21 R12.1 C16.1
K64F_DAPLINK_CTS  (via drill 0.25, 0.25 layers 15-16)
  Top 0.152: v20.7,14.73 20.19,14.22 19.45,14.22 IC2.30
  +3.3v 0.152: v19.43,10.79 19.43,13.46 v20.7,14.73
  Bottom 0.152: IC1.56 19.88,9.33 19.43,9.78 v19.43,10.79
K64F_DAPLINK_RTS  (via drill 0.25)
  Top 0.152: v14.35,9.52 14.35,11.7 IC2.16
  Bottom 0.152: IC1.55 19.88,8.83 19.18,9.52 18.54,9.52 17.27,8.25 14.86,8.25 14.35,8.76 v14.35,9.52
K64F_DAPLINK_RX  (via drill 0.25)
  Top 0.152: IC2.32 19.44,15.99 v19.43,16
  Bottom 0.152: IC1.62 20.31,12.33 19.43,13.21 v19.43,16
K64F_DAPLINK_TX  (via drill 0.25)
  Top 0.152: IC2.31 19.92,14.71 20.19,14.99 v20.19,16.38
  Bottom 0.152: IC1.63 20.32,12.83 19.81,13.33 19.81,15.49 20.19,15.88 v20.19,16.38
K64F_RPI_RX  (via drill 0.25)
  +3.3v 0.152: v39.75,17.53 37.34,15.11 37.34,4.57 35.94,3.17 18.29,3.17 JP1.3
  Bottom 0.152: IC1.2 38.95,18.33 v39.75,17.53
K64F_RPI_TX  (via drill 0.25)
  +3.3v 0.152: JP1.1 11.56,2.92 11.94,3.3 14.22,3.3 14.86,3.94 35.43,3.94 36.58,5.08 36.58,15.88 39.12,18.41 v40.51,18.41
  Bottom 0.152: IC1.1 40.1,18.83 v40.51,18.41
LED_BLUE  (via drill 0.25)
  Top 0.152: v16.46,21.01 R6.1
  Bottom 0.152: IC1.67 21.5,14.83 20.96,15.37 20.96,16.76 20.7,17.02 19.94,17.02 19.3,17.65 18.92,17.65 16.46,20.12 v16.46,21.01
LED_COM_GREEN
  Top 0.152: IC2.21 17.14,9.4 17.53,9.02 17.53,7.11 17.15,6.73 13.08,6.73 12.83,6.98 LED6.C
LED_DAP_BLUE  (via drill 0.25)
  Top 0.152: IC2.12 13.72,13.71 13.59,13.84 13.59,14.1 v13.21,14.48 | LED5.C 11.43,6.98 11.18,6.73 10.92,6.73 10.67,6.48 10.67,5.21 9.02,3.56 v9.02,2.54
  GND 0.152: v9.02,2.54 9.02,5.71 10.03,6.73 10.03,13.59 10.92,14.48 v13.21,14.48
LED_GREEN  (via drill 0.25, 0.25 layers 15-16)
  Top 0.152: v19.18,21.21 19.18,22.81 R5.1
  +3.3v 0.152: v27.18,18.29 22.1,18.29 v19.18,21.21
  Bottom 0.152: IC1.33 32.98,12.49 v27.18,18.29
LED_PWR_RED  (via drill 0.25)
  Top 0.152: IC2.7 15.64,16.49 15.37,16.76 14.22,16.76 v14.1,16.64 | v15.24,7.49 15.23,7.48 LED7.C
  GND 0.152: v14.1,16.64 15.37,15.37 16.64,15.37 18.41,13.59 18.41,9.91 16,7.49 v15.24,7.49
LED_RED  (via drill 0.25)
  Top 0.152: R4.1 21.79,22.3 21.59,22.1 20.19,22.1 19.94,21.84 19.94,20.83 20.19,20.57 v20.19,18.16
  Bottom 0.152: IC1.68 21.5,15.33 21.34,15.49 21.34,17.02 v20.19,18.16
N$2
  Bottom 0.254: IC1.28 35.48,3.13 35.69,2.92 Q1.X1 36.51,3 C1.1
N$3
  Bottom 0.254: IC1.29 34.98,3.1 34.8,2.92 Q1.X2 33.85,3 C2.1
N$4
  Bottom 0.254: IC1.77 24.98,22.24 R7.1
N$5
  Top 0.152: R17.2 R16.2 SW1.P$2
N$6
  Bottom 0.254: IC1.13 IC1.12 40.01,13.33 R3.1
N$7  (via drill 0.25)
  Top 0.152: MOD1.10 v31.75,24.38
  Bottom 0.152: v31.75,24.38 R9.1
N$8
  Top 0.152: LED2.C 20.84,22.9 R4.2
N$9
  Top 0.152: LED3.C 18.17,22.9 R5.2
N$10
  Top 0.152: LED4.C 15.51,22.9 R6.2
N$11  (via drill 0.25)
  Top 0.152: MOD1.34 32.75,1.41 v33.02,1.14
  Bottom 0.152: R8.1 33.01,1 v33.02,1.14
N$12  (via drill 0.25)
  Top 0.152: v31.24,1.14 31.75,1.65 MOD1.33
  Top 0.254: 31.64,2.7 MOD1.33
  Bottom 0.152: R10.2 v31.23,1.13 v31.24,1.14
N$13  (via drill 0.25)
  Top 0.406: MOD1.4 MOD1.3 38.73,22.84 v38.73,24.51
  Bottom 0.406: C13.1 C14.1 L1.2 37.97,23.75 v38.73,24.51
N$17
  Top 0.152: LED1.A R2.1
N$18
  Top 0.152: IC2.5 16.64,17.01 15.93,17.73 Q2.P$1 C18.1
N$19
  Top 0.152: IC2.4 17.14,17.15 16.89,17.4 16.89,18.8 17.4,19.3 17.78,19.3 18.11,19.63 Q2.P$3 18.24,20.27 C19.1
N$20
  Top 0.152: IC2.9 12.6,15.21 12.27,15.54 R11.1
N$23
  Top 0.152: T1.3 8.89,8.64 10.16,9.91 R19.1
N$36
  Top 0.152: LED6.A R14.2
N$37
  Top 0.152: LED7.A R15.2
N$38
  Top 0.152: LED5.A R13.2
N$39
  Top 0.254: CON1.D+ 7.29,13.7 IC3.1
N$40
  Top 0.254: CON1.D- 7.29,11.7 IC3.3
REMAP_IO
  Top 0.152: IC2.20 R18.2
RF_DIG3  (via drill 0.25, 0.25 layers 1-2)
  Top 0.152: v29.97,1.14 30.75,1.92 MOD1.32 30.75,4.17 30.23,4.7 30.23,10.54 v25.78,14.99
  Bottom 0.152: v25.78,14.99 24.97,15.83 IC1.69
RF_FEM_SEL  (via drill 0.25, 0.25 layers 1-2)
  Top 0.152: MOD1.38 36.75,1.35 v37.21,0.89
  GND 0.152: v37.21,0.89 37.34,8.25 37.34,9.02 36.2,10.16 v21.59,10.16
  Bottom 0.152: v21.59,10.16 21.97,9.78 22.68,9.78 IC1.57
RF_IRQ  (via drill 0.25, 0.25 layers 1-2)
  Top 0.152: v38.73,0.89 38.73,2.8 MOD1.40
  GND 0.152: v23.75,22.99 23.75,20.57 29.72,14.6 34.16,14.6 38.73,10.03 v38.73,0.89
  Bottom 0.152: IC1.76 24.48,21.37 23.75,22.1 v23.75,22.99
RF_MISO  (via drill 0.25, 0.25 layers 15-16)
  Top 0.152: MOD1.8 33.78,22.82 v33.78,24.38
  +3.3v 0.152: v33.78,22.1 v33.78,24.38
  Bottom 0.152: IC1.96 34.48,21.4 v33.78,22.1
RF_MOSI  (via drill 0.25, 0.25 layers 15-16)
  Top 0.152: MOD1.7 34.8,22.86 v34.8,24.38
  +3.3v 0.152: v34.8,17.53 v34.8,24.38
  Bottom 0.152: IC1.95 33.98,18.34 v34.8,17.53
RF_NRESET  (via drill 0.25, 0.25 layers 15-16)
  Top 0.152: MOD1.5 36.83,22.9 v36.83,24.38
  +3.3v 0.152: v36.07,17.53 36.07,21.46 36.83,22.23 v36.83,24.38
  Bottom 0.152: IC1.97 34.98,18.61 v36.07,17.53
RF_NSEL  (via drill 0.25)
  Top 0.152: MOD1.6 35.81,22.88 v35.81,24.38
  Bottom 0.152: IC1.93 32.98,22.69 33.53,23.24 35.56,23.24 35.81,23.49 v35.81,24.38
RF_SCL  (via drill 0.25, 0.25 layers 1-2)
  Top 0.152: MOD1.36 34.75,1.31 v35.18,0.89
  GND 0.152: v34.29,6.98 33.53,6.22 33.53,4.19 35.18,2.54 v35.18,0.89
  Bottom 0.152: IC1.31 33.98,6.67 v34.29,6.98
RF_SCLK  (via drill 0.25, 0.25 layers 15-16)
  Top 0.152: MOD1.9 32.77,22.83 v32.77,24.38
  +3.3v 0.152: v32.77,18.03 v32.77,24.38
  Bottom 0.152: IC1.94 33.48,18.75 v32.77,18.03
RF_SDA  (via drill 0.25, 0.25 layers 1-2)
  Top 0.152: MOD1.37 35.75,1.33 v36.2,0.89
  GND 0.152: v36.2,0.89 36.2,7.62 35.43,8.38 v33.78,8.38
  Bottom 0.152: v33.78,8.38 33.48,8.08 IC1.32
RF_SLP_TR  (via drill 0.25, 0.25 layers 1-2)
  Top 0.152: v34.16,0.89 33.75,1.3 MOD1.35 33.75,6.51 31.24,9.02 31.24,11.43 v25.53,17.14
  Bottom 0.152: v25.53,17.14 24.84,17.83 IC1.73
TGT_NRESET  (via drill 0.25, 0.25 layers 15-16)
  Top 0.152: IC2.8 13.71,16.01 13.34,16.38 13.34,17.91 v12.7,18.54
  +3.3v 0.152: v18.8,8.64 13.59,8.64 12.19,10.03 12.19,16.89 12.7,17.4 v12.7,18.54
  Bottom 0.152: IC1.52 19.44,7.33 C3.1 | R1.1 18.29,8.13 v18.8,8.64
  Bottom 0.254: R1.1 C3.1
TGT_NRESET_FB  (via drill 0.25)
  Top 0.152: IC2.1 18.64,16.86 18.8,17.02 v19.05,17.02 | R16.1 v12.45,20.7
  Bottom 0.152: v12.45,20.7 15.24,20.7 v19.05,17.02
TGT_NRESET_FB_ISP  (via drill 0.25)
  Top 0.152: IC2.3 17.64,17.39 v17.65,17.53 | v9.65,19.68 R17.1
  Bottom 0.152: v17.65,17.53 15.62,19.68 v9.65,19.68
TGT_SWCLK  (via drill 0.25, 0.25 layers 15-16)
  Top 0.152: v16,9.27 16,9.91 15.64,10.27 IC2.18
  +3.3v 0.152: v16,9.27 18.03,9.27 18.29,9.52 18.8,9.52 19.56,8.76 19.56,7.87 21.97,5.46 30.99,5.46 v32.13,6.6
  Bottom 0.152: IC1.34 32.51,5.11 32.51,6.22 v32.13,6.6
TGT_SWDIO  (via drill 0.25, 0.25 layers 15-16)
  Top 0.152: IC2.17 v15.14,9.81
  +3.3v 0.152: v15.14,9.81 15.49,10.16 18.67,10.16 20.45,8.38 20.45,7.62 22.1,5.97 30.23,5.97 v30.99,6.73
  Bottom 0.152: v30.99,6.73 IC1.37
USB-D+
  Top 0.254: R21.1 10.16,14.35 9.94,14.13 IC3.6
USB-D-
  Top 0.254: IC3.4 11.04,11.75 R20.1
USB-DM  (via drill 0.25)
  Top 0.254: C20.1 R20.2 v12.73,11.94 | IC2.13 13.2,13.21 v12.76,13.72
  Bottom 0.254: v12.73,11.94 12.73,13.68 v12.76,13.72
USB-DP
  Top 0.152: R19.2 12.78,9.91 13.28,10.41 13.28,12.56 13.13,12.71
  Top 0.254: R21.2 C21.1 12.45,12.95 12.69,12.71 13.13,12.71 IC2.14
USB-SCON
  Top 0.152: IC2.15 13.74,12.21 13.59,12.06 13.59,9.78 12.83,9.02 10.16,9.02 9.84,8.7 T1.1
VBUS_IF  (via drill 0.25)
  Top 0.406: CON1.VBUS 6.79,9.2 v6.86,9.27 6.91,9.22 IC4.3 8.64,9.88 8.64,12.32 9.02,12.7 IC3.5
  Bottom 0.406: v6.86,9.27 7.93,9.27 IC4.3

### Text on the board
Top: cjs
tPlace: BLU | GRN | RED | DAP | COM | PWR | TX | RX
tNames: github.com/ARMmbed/mbed-HDK | mbed USB Border Router | v1.0.0